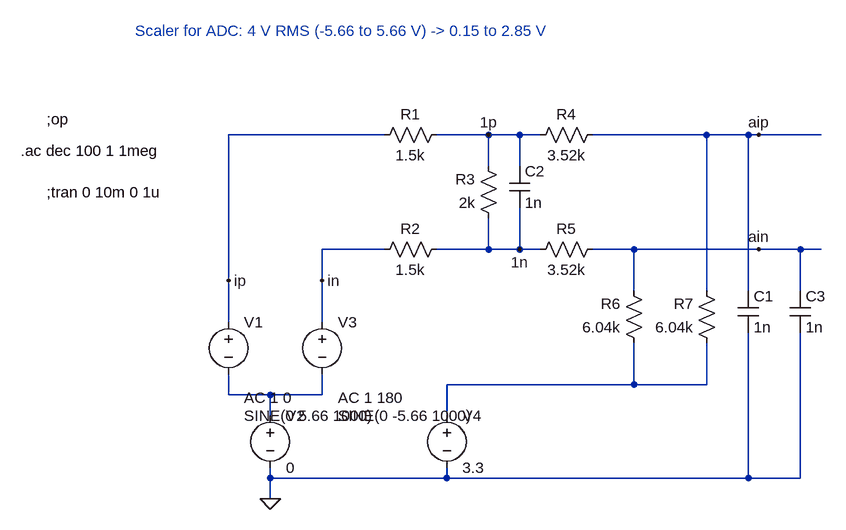
[diagram p0: schematic ad_scaler.asc]
ad_scaler.asc, the LTspice schematic file:
Version 4
SHEET 1 1020 680
WIRE 336 -160 96 -160
WIRE 496 -160 416 -160
WIRE 544 -160 496 -160
WIRE 576 -160 544 -160
WIRE 832 -160 656 -160
WIRE 896 -160 832 -160
WIRE 912 -160 896 -160
WIRE 1008 -160 912 -160
WIRE 496 -112 496 -160
WIRE 544 -112 544 -160
WIRE 336 16 240 16
WIRE 496 16 496 -32
WIRE 496 16 416 16
WIRE 544 16 544 -48
WIRE 544 16 496 16
WIRE 576 16 544 16
WIRE 720 16 656 16
WIRE 912 16 720 16
WIRE 976 16 912 16
WIRE 1008 16 976 16
WIRE 96 64 96 -160
WIRE 240 64 240 16
WIRE 720 80 720 16
WIRE 832 80 832 -160
WIRE 896 80 896 -160
WIRE 976 80 976 16
WIRE 96 128 96 64
WIRE 240 128 240 64
WIRE 720 224 720 160
WIRE 720 224 432 224
WIRE 832 224 832 160
WIRE 832 224 720 224
WIRE 96 240 96 208
WIRE 160 240 96 240
WIRE 240 240 240 208
WIRE 240 240 160 240
WIRE 160 272 160 240
WIRE 432 272 432 224
WIRE 160 368 160 352
WIRE 432 368 432 352
WIRE 432 368 160 368
WIRE 896 368 896 144
WIRE 896 368 432 368
WIRE 976 368 976 144
WIRE 976 368 896 368
WIRE 160 400 160 368
FLAG 160 400 0
FLAG 96 64 ip
FLAG 240 64 in
FLAG 912 -160 aip
FLAG 912 16 ain
FLAG 496 -160 1p
FLAG 544 16 1n
SYMBOL voltage 96 112 R0
WINDOW 3 24 160 Left 0
WINDOW 123 24 132 Left 0
WINDOW 39 0 0 Left 0
SYMATTR Value SINE(0 5.66 1000)
SYMATTR Value2 AC 1 0
SYMATTR InstName V1
SYMBOL voltage 160 256 R0
WINDOW 123 0 0 Left 0
WINDOW 39 0 0 Left 0
SYMATTR InstName V2
SYMATTR Value 0
SYMBOL voltage 240 112 R0
WINDOW 3 24 160 Left 0
WINDOW 123 24 132 Left 0
WINDOW 39 0 0 Left 0
SYMATTR Value SINE(0 -5.66 1000)
SYMATTR Value2 AC 1 180
SYMATTR InstName V3
SYMBOL res 432 -176 R90
WINDOW 0 0 56 VBottom 0
WINDOW 3 32 56 VTop 0
SYMATTR InstName R1
SYMATTR Value 1.5k
SYMBOL res 432 0 R90
WINDOW 0 0 56 VBottom 0
WINDOW 3 32 56 VTop 0
SYMATTR InstName R2
SYMATTR Value 1.5k
SYMBOL res 512 -16 R180
WINDOW 0 36 76 Left 0
WINDOW 3 36 40 Left 0
SYMATTR InstName R3
SYMATTR Value 2k
SYMBOL res 560 -144 R270
WINDOW 0 32 56 VTop 0
WINDOW 3 0 56 VBottom 0
SYMATTR InstName R4
SYMATTR Value 3.52k
SYMBOL res 560 32 R270
WINDOW 0 32 56 VTop 0
WINDOW 3 0 56 VBottom 0
SYMATTR InstName R5
SYMATTR Value 3.52k
SYMBOL res 736 176 R180
WINDOW 0 36 76 Left 0
WINDOW 3 36 40 Left 0
SYMATTR InstName R6
SYMATTR Value 6.04k
SYMBOL res 848 176 R180
WINDOW 0 36 76 Left 0
WINDOW 3 36 40 Left 0
SYMATTR InstName R7
SYMATTR Value 6.04k
SYMBOL voltage 432 256 R0
WINDOW 123 0 0 Left 0
WINDOW 39 0 0 Left 0
SYMATTR InstName V4
SYMATTR Value 3.3
SYMBOL cap 528 -112 R0
SYMATTR InstName C2
SYMATTR Value 1n
SYMBOL cap 880 80 R0
SYMATTR InstName C1
SYMATTR Value 1n
SYMBOL cap 960 80 R0
SYMATTR InstName C3
SYMATTR Value 1n
TEXT -184 -184 Left 0 !;op
TEXT -224 -136 Left 0 !.ac dec 100 1 1meg
TEXT -184 -72 Left 0 !;tran 0 10m 0 1u
TEXT -48 -320 Left 0 ;Scaler for ADC: 4 V RMS (-5.66 to 5.66 V) -> 0.15 to 2.85 V

The netlist it stands for:
* ad_scaler.asc
V1 ip N002 SINE(0 5.66 1000) AC 1 0
V2 N002 0 0
V3 in N002 SINE(0 -5.66 1000) AC 1 180
R1 1p ip 1.5k
R2 1n in 1.5k
R3 1n 1p 2k
R4 1p aip 3.52k
R5 1n ain 3.52k
R6 N001 ain 6.04k
R7 N001 aip 6.04k
V4 N001 0 3.3
C2 1p 1n 1n
C1 aip 0 1n
C3 ain 0 1n
;op
.ac dec 100 1 1meg
;tran 0 10m 0 1u
* Scaler for ADC: 4 V RMS (-5.66 to 5.66 V) -> 0.15 to 2.85 V
.backanno
.end